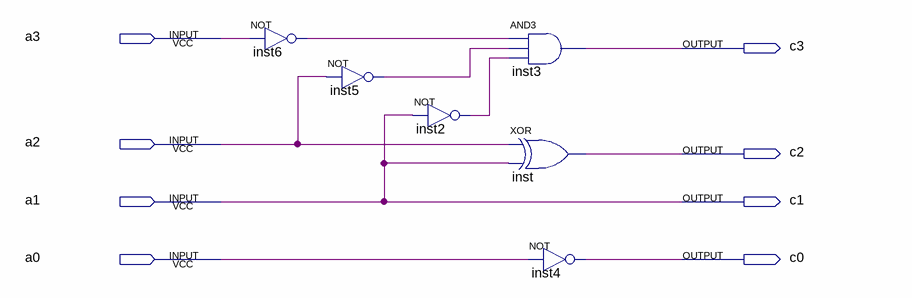
[diagram p0: schematic sheet]
// Quartus schematic BCD_9com.bdf as structural Verilog: 6 symbols, 8 pins
module BCD_9com (
  input  a3,
  input  a2,
  input  a1,
  input  a0,
  output c3,
  output c2,
  output c1,
  output c0
);

  wire inst2_out, inst5_out, inst6_out;

  not inst6 (inst6_out, a3);
  not inst5 (inst5_out, a2);
  not inst2 (inst2_out, a1);
  and inst3 (c3, inst6_out, inst5_out, inst2_out);
  xor inst (c2, a2, a1);
  not inst4 (c0, a0);

  assign c1 = a1;
endmodule
